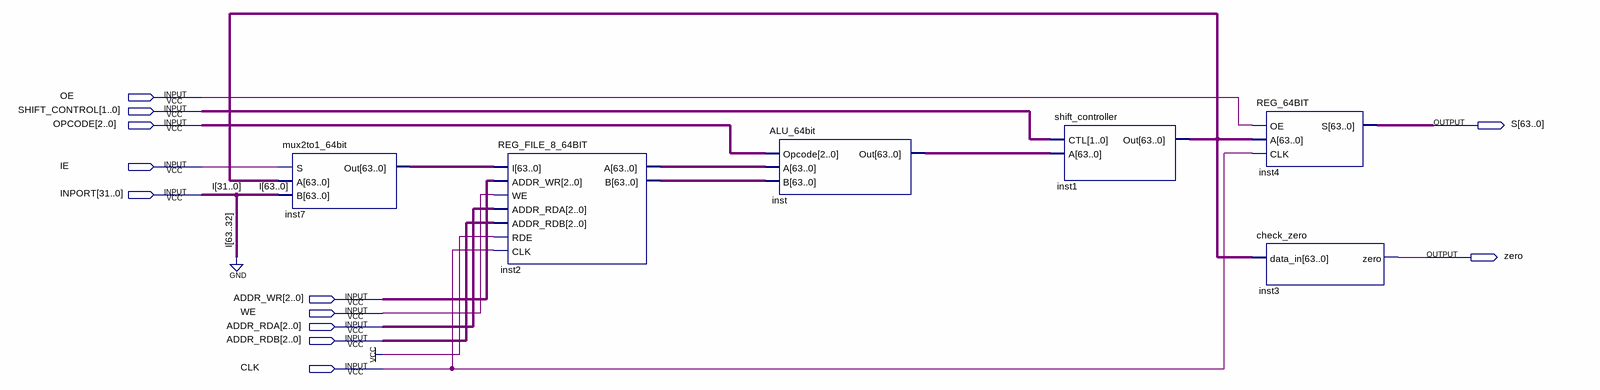
[diagram p0: schematic sheet]
// Quartus schematic DATAPATH.bdf as structural Verilog: 6 symbols, 12 pins
module DATAPATH (
  input  OE,
  input  [1:0] SHIFT_CONTROL,
  input  [2:0] OPCODE,
  input  IE,
  input  [31:0] INPORT,
  input  [2:0] ADDR_WR,
  input  WE,
  input  [2:0] ADDR_RDA,
  input  [2:0] ADDR_RDB,
  input  CLK,
  output [63:0] S,
  output zero
);

  wire [63:0] inst1_out, inst2_a, inst2_b, inst7_out, inst_out;

  mux2to1_64bit inst7 (.S(IE), .A(inst1_out), .B({{32{1'b0}}, INPORT}), .Out(inst7_out));
  REG_FILE_8_64BIT inst2 (
    .I(inst7_out), .ADDR_WR(ADDR_WR), .WE(WE), .ADDR_RDA(ADDR_RDA), .ADDR_RDB(ADDR_RDB), .RDE(1'b1),
    .CLK(CLK), .A(inst2_a), .B(inst2_b));
  ALU_64bit inst (.Opcode(OPCODE), .A(inst2_a), .B(inst2_b), .Out(inst_out));
  shift_controller inst1 (.CTL(SHIFT_CONTROL), .A(inst_out), .Out(inst1_out));
  REG_64BIT inst4 (.OE(OE), .A(inst1_out), .CLK(CLK), .S(S));
  check_zero inst3 (.data_in(inst1_out), .zero(zero));

  // Other names for the same wires on the sheet: I[31:0] = INPORT
endmodule
